# EAGLE schematic ESP8266_MODULE_HEADER (EAGLE 7.7.0)
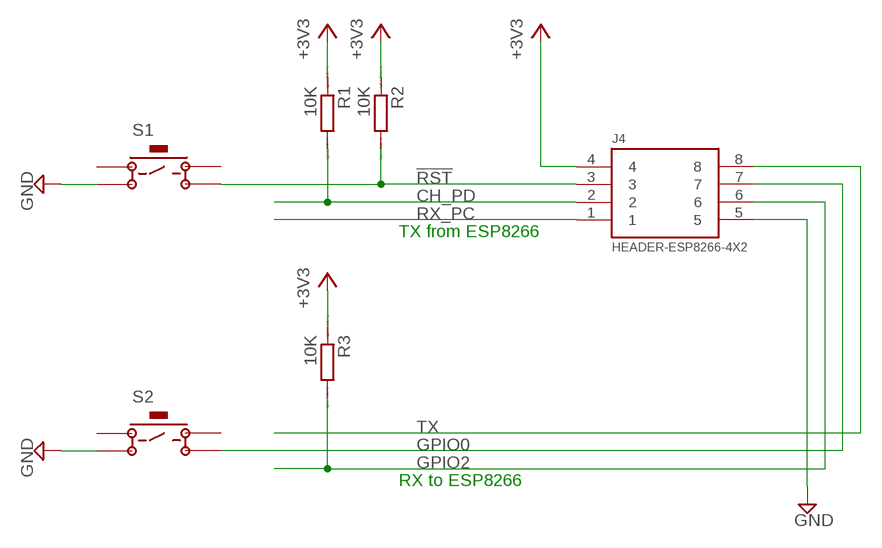
[diagram p0: schematic, sheet 1]

## Parts
J4  HEADER-ESP8266-4X2  [HEADER-4X2-A]
R1  10K  R-EU_0204_7  [0204/7]
R2  10K  R-EU_0204_7  [0204/7]
R3  10K  R-EU_0204_7  [0204/7]
S1  1825910-6-SPST-NOPB-4P  [SW-NOPB-4]
S2  1825910-6-SPST-NOPB-4P  [SW-NOPB-4]

## Nets
!RST: J4.3 R2.2 S1.4
+3V3: J4.4 R1.1 R2.1 R3.1
CH_PD: J4.2 R1.2
GND: J4.5 S1.2 S2.2
GPIO0: J4.7 S2.4
GPIO2: J4.6 R3.2
RX_PC: J4.1
TX: J4.8
Unconnected: S1.1 S1.3 S2.1 S2.3

## Notes on the sheet
- TX from ESP8266
- RX to ESP8266

## Library data of the parts
J4 = HEADER-4X2-A:HEADER-ESP8266-4X2
R1-R3 = resistor:R-EU_: RESISTOR, European symbol; SPICEPREFIX: R
S1 S2 = 1825910-6:1825910-6-SPST-NOPB-4P